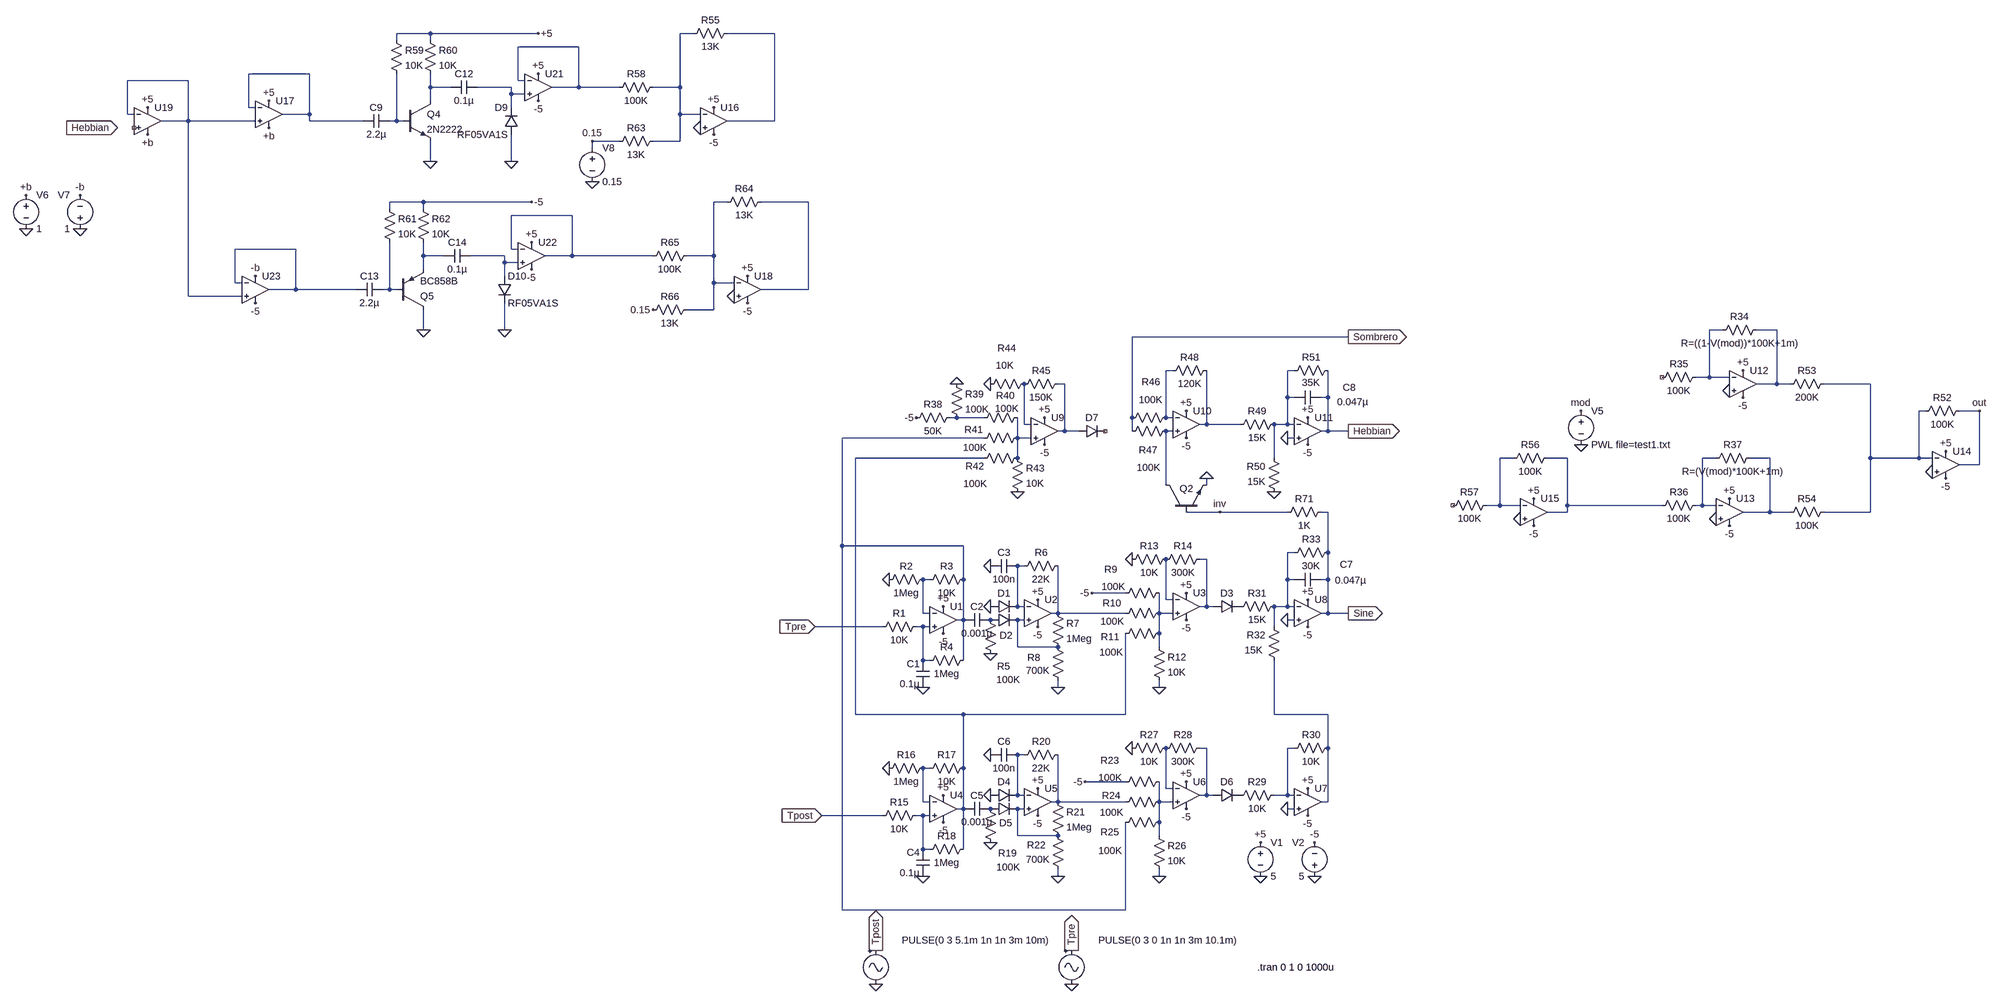
[diagram p0: schematic dopamine-sum-schV2.asc]
dopamine-sum-schV2.asc, the LTspice schematic file:
Version 4
SHEET 1 2868 1552
WIRE -992 -1392 -1072 -1392
WIRE -736 -1392 -992 -1392
WIRE -368 -1392 -400 -1392
WIRE -176 -1392 -288 -1392
WIRE -1072 -1376 -1072 -1392
WIRE -992 -1376 -992 -1392
WIRE -640 -1360 -784 -1360
WIRE -1312 -1296 -1456 -1296
WIRE -1616 -1280 -1760 -1280
WIRE -784 -1280 -784 -1360
WIRE -768 -1280 -784 -1280
WIRE -992 -1264 -992 -1296
WIRE -944 -1264 -992 -1264
WIRE -800 -1264 -880 -1264
WIRE -640 -1264 -640 -1360
WIRE -640 -1264 -704 -1264
WIRE -544 -1264 -640 -1264
WIRE -400 -1264 -400 -1392
WIRE -400 -1264 -464 -1264
WIRE -800 -1248 -800 -1264
WIRE -768 -1248 -800 -1248
WIRE -992 -1232 -992 -1264
WIRE -1456 -1216 -1456 -1296
WIRE -1440 -1216 -1456 -1216
WIRE -800 -1216 -800 -1248
WIRE -1760 -1200 -1760 -1280
WIRE -1744 -1200 -1760 -1200
WIRE -1312 -1200 -1312 -1296
WIRE -1312 -1200 -1376 -1200
WIRE -400 -1200 -400 -1264
WIRE -352 -1200 -400 -1200
WIRE -1616 -1184 -1616 -1280
WIRE -1616 -1184 -1680 -1184
WIRE -1440 -1184 -1616 -1184
WIRE -1312 -1184 -1312 -1200
WIRE -1152 -1184 -1312 -1184
WIRE -1072 -1184 -1072 -1296
WIRE -1072 -1184 -1088 -1184
WIRE -1056 -1184 -1072 -1184
WIRE -176 -1184 -176 -1392
WIRE -176 -1184 -288 -1184
WIRE -544 -1136 -608 -1136
WIRE -400 -1136 -400 -1200
WIRE -400 -1136 -464 -1136
WIRE -608 -1120 -608 -1136
WIRE -992 -1088 -992 -1136
WIRE -800 -1088 -800 -1152
WIRE -1008 -992 -1088 -992
WIRE -752 -992 -1008 -992
WIRE -288 -992 -320 -992
WIRE -96 -992 -208 -992
WIRE -1088 -976 -1088 -992
WIRE -1008 -976 -1008 -992
WIRE -656 -960 -800 -960
WIRE -1344 -880 -1488 -880
WIRE -800 -880 -800 -960
WIRE -784 -880 -800 -880
WIRE -1008 -864 -1008 -896
WIRE -960 -864 -1008 -864
WIRE -816 -864 -896 -864
WIRE -656 -864 -656 -960
WIRE -656 -864 -720 -864
WIRE -464 -864 -656 -864
WIRE -320 -864 -320 -992
WIRE -320 -864 -384 -864
WIRE -816 -848 -816 -864
WIRE -784 -848 -816 -848
WIRE -1008 -832 -1008 -864
WIRE -816 -816 -816 -848
WIRE -1488 -800 -1488 -880
WIRE -1472 -800 -1488 -800
WIRE -320 -800 -320 -864
WIRE -272 -800 -320 -800
WIRE -1344 -784 -1344 -880
WIRE -1344 -784 -1408 -784
WIRE -1168 -784 -1344 -784
WIRE -1088 -784 -1088 -896
WIRE -1088 -784 -1104 -784
WIRE -1072 -784 -1088 -784
WIRE -96 -784 -96 -992
WIRE -96 -784 -208 -784
WIRE -1616 -768 -1616 -1184
WIRE -1472 -768 -1616 -768
WIRE -320 -736 -320 -800
WIRE -320 -736 -384 -736
WIRE -1008 -688 -1008 -736
WIRE -816 -688 -816 -752
WIRE 2160 -688 2128 -688
WIRE 2288 -688 2240 -688
WIRE 1184 -672 672 -672
WIRE 768 -592 752 -592
WIRE 1056 -592 1040 -592
WIRE 2128 -576 2128 -688
WIRE 2128 -576 2096 -576
WIRE 2176 -576 2128 -576
WIRE 512 -560 496 -560
WIRE 2288 -560 2288 -688
WIRE 2288 -560 2240 -560
WIRE 2320 -560 2288 -560
WIRE 2560 -560 2400 -560
WIRE 1040 -528 1040 -592
WIRE 1056 -528 1040 -528
WIRE 1136 -528 1136 -592
WIRE 1136 -528 1120 -528
WIRE 2704 -496 2688 -496
WIRE 2832 -496 2784 -496
WIRE 256 -480 240 -480
WIRE 320 -480 256 -480
WIRE 672 -480 672 -672
WIRE 752 -480 752 -592
WIRE 768 -480 752 -480
WIRE 416 -464 416 -560
WIRE 432 -464 416 -464
WIRE 848 -464 848 -592
WIRE 848 -464 832 -464
WIRE 928 -464 848 -464
WIRE 1040 -464 1040 -528
WIRE 1040 -464 1008 -464
WIRE 1056 -464 1040 -464
WIRE 512 -448 512 -560
WIRE 512 -448 496 -448
WIRE 544 -448 512 -448
WIRE 672 -448 672 -480
WIRE 768 -448 752 -448
WIRE 1136 -448 1136 -528
WIRE 1136 -448 1120 -448
WIRE 1184 -448 1136 -448
WIRE 320 -432 -16 -432
WIRE 400 -432 400 -480
WIRE 432 -432 400 -432
WIRE 1056 -432 1040 -432
WIRE 320 -384 16 -384
WIRE 400 -384 400 -432
WIRE 1008 -384 1008 -464
WIRE 1664 -384 1632 -384
WIRE 1792 -384 1744 -384
WIRE 2144 -384 2112 -384
WIRE 2272 -384 2224 -384
WIRE 2560 -384 2560 -560
WIRE 2688 -384 2688 -496
WIRE 2688 -384 2560 -384
WIRE 2720 -384 2688 -384
WIRE 2832 -368 2832 -496
WIRE 2832 -368 2784 -368
WIRE 752 -320 752 -448
WIRE 848 -320 848 -336
WIRE 1632 -272 1632 -384
WIRE 1632 -272 1600 -272
WIRE 1680 -272 1632 -272
WIRE 1792 -272 1792 -384
WIRE 2016 -272 1792 -272
WIRE 2112 -272 2112 -384
WIRE 2112 -272 2096 -272
WIRE 2144 -272 2112 -272
WIRE 880 -256 800 -256
WIRE 1040 -256 880 -256
WIRE 1136 -256 1120 -256
WIRE 1792 -256 1792 -272
WIRE 1792 -256 1744 -256
WIRE 2272 -256 2272 -384
WIRE 2272 -256 2208 -256
WIRE 2320 -256 2272 -256
WIRE 2560 -256 2560 -384
WIRE 2560 -256 2400 -256
WIRE -16 -176 -16 -432
WIRE 272 -176 -16 -176
WIRE 1056 -160 1040 -160
WIRE 1136 -160 1136 -256
WIRE 848 -144 832 -144
WIRE 416 -128 400 -128
WIRE 192 -96 176 -96
WIRE 272 -96 272 -176
WIRE 1040 -96 1040 -160
WIRE 1056 -96 1040 -96
WIRE 1136 -96 1136 -160
WIRE 1136 -96 1120 -96
WIRE 656 -64 576 -64
WIRE 752 -48 752 -144
WIRE 768 -48 752 -48
WIRE 400 -32 400 -128
WIRE 416 -32 400 -32
WIRE 848 -32 848 -144
WIRE 848 -32 832 -32
WIRE 864 -32 848 -32
WIRE 1040 -32 1040 -96
WIRE 1040 -32 1008 -32
WIRE 1056 -32 1040 -32
WIRE 176 -16 176 -96
WIRE 192 -16 176 -16
WIRE 496 -16 496 -128
WIRE 496 -16 480 -16
WIRE 656 -16 496 -16
WIRE 736 -16 736 -64
WIRE 768 -16 736 -16
WIRE 1136 -16 1136 -96
WIRE 1136 -16 1120 -16
WIRE 1184 -16 1136 -16
WIRE 272 0 272 -96
WIRE 272 0 256 0
WIRE 416 0 400 0
WIRE 1056 0 1040 0
WIRE 80 16 -80 16
WIRE 176 16 160 16
WIRE 192 16 176 16
WIRE 1008 16 1008 -32
WIRE 736 32 736 -16
WIRE 400 64 400 0
WIRE 496 64 400 64
WIRE 736 64 736 32
WIRE 176 96 176 16
WIRE 192 96 176 96
WIRE 272 96 272 0
WIRE 496 160 496 144
WIRE 736 160 736 144
WIRE 16 224 16 -384
WIRE 272 224 16 224
WIRE 656 224 656 32
WIRE 656 224 272 224
WIRE 1008 224 1008 96
WIRE 1136 224 1008 224
WIRE 848 304 832 304
WIRE 1056 304 1040 304
WIRE 1136 304 1136 224
WIRE 416 320 400 320
WIRE 192 352 176 352
WIRE 272 352 272 224
WIRE 656 384 560 384
WIRE 752 400 752 304
WIRE 768 400 752 400
WIRE 400 416 400 320
WIRE 416 416 400 416
WIRE 848 416 848 304
WIRE 848 416 832 416
WIRE 864 416 848 416
WIRE 1040 416 1040 304
WIRE 1040 416 1008 416
WIRE 1056 416 1040 416
WIRE 176 432 176 352
WIRE 192 432 176 432
WIRE 496 432 496 320
WIRE 496 432 480 432
WIRE 656 432 496 432
WIRE 736 432 736 384
WIRE 768 432 736 432
WIRE 1136 432 1136 304
WIRE 1136 432 1120 432
WIRE 272 448 272 352
WIRE 272 448 256 448
WIRE 416 448 400 448
WIRE 1056 448 1040 448
WIRE 80 464 -64 464
WIRE 176 464 160 464
WIRE 192 464 176 464
WIRE 736 480 736 432
WIRE 400 512 400 448
WIRE 496 512 400 512
WIRE 736 512 736 480
WIRE 176 544 176 464
WIRE 192 544 176 544
WIRE 272 544 272 448
WIRE 496 608 496 592
WIRE 736 608 736 592
WIRE -16 688 -16 -176
WIRE 656 688 656 480
WIRE 656 688 -16 688
FLAG 800 -64 +5
FLAG 800 0 -5
FLAG 528 864 0
FLAG 64 864 0
FLAG 224 -32 +5
FLAG 224 32 -5
FLAG 448 -48 +5
FLAG 448 16 -5
FLAG 336 -32 0
FLAG 336 -128 0
FLAG 336 80 0
FLAG 672 -144 0
FLAG 576 -64 -5
FLAG 448 400 +5
FLAG 448 464 -5
FLAG 336 416 0
FLAG 336 320 0
FLAG 336 528 0
FLAG 496 608 0
FLAG 496 160 0
FLAG 800 384 +5
FLAG 800 448 -5
FLAG 672 304 0
FLAG 560 384 -5
FLAG 176 160 0
FLAG 96 -96 0
FLAG 224 416 +5
FLAG 224 480 -5
FLAG 176 608 0
FLAG 96 352 0
FLAG 1088 -48 +5
FLAG 1088 16 -5
FLAG 1088 400 +5
FLAG 1088 464 -5
FLAG 1040 448 0
FLAG 1040 0 0
FLAG 736 160 0
FLAG 736 608 0
FLAG 1184 -16 Sine
IOPIN 1184 -16 Out
FLAG 464 -480 +5
FLAG 464 -416 -5
FLAG 336 -560 0
FLAG 256 -560 0
FLAG 800 -496 +5
FLAG 800 -432 -5
FLAG 160 -480 -5
FLAG 1088 -480 +5
FLAG 1088 -416 -5
FLAG 1040 -432 0
FLAG 1008 -304 0
FLAG 848 -336 0
FLAG 1184 -448 Hebbian
IOPIN 1184 -448 Out
FLAG 1184 -672 Sombrero
IOPIN 1184 -672 Out
FLAG 976 608 0
FLAG 1104 608 0
FLAG 1104 528 -5
FLAG 976 528 +5
FLAG -64 464 Tpost
IOPIN -64 464 In
FLAG 64 784 Tpost
IOPIN 64 784 Out
FLAG -80 16 Tpre
IOPIN -80 16 In
FLAG 528 784 Tpre
IOPIN 528 784 Out
FLAG 400 -304 0
FLAG 2176 -288 +5
FLAG 2176 -224 -5
FLAG 2208 -592 +5
FLAG 2208 -528 -5
FLAG 2176 -544 0
FLAG 2144 -240 0
FLAG 2752 -400 +5
FLAG 2752 -336 -5
FLAG 2720 -352 0
FLAG 1824 -416 0
FLAG 1824 -496 mod
FLAG 2832 -496 out
FLAG 1712 -288 +5
FLAG 1712 -224 -5
FLAG 1680 -240 0
FLAG 880 -256 inv
FLAG -800 -1088 0
FLAG -992 -1088 0
FLAG -736 -1392 +5
FLAG -1408 -1232 +5
FLAG -736 -1296 +5
FLAG -736 -1232 -5
FLAG -816 -688 0
FLAG -1008 -688 0
FLAG -752 -896 +5
FLAG -752 -832 -5
FLAG -752 -992 -5
FLAG -1440 -752 -5
FLAG -2000 -928 0
FLAG -1872 -928 0
FLAG -1872 -1008 -b
FLAG -2000 -1008 +b
FLAG -320 -1216 +5
FLAG -320 -1152 -5
FLAG -352 -1168 0
FLAG -608 -1040 0
FLAG -240 -816 +5
FLAG -240 -752 -5
FLAG -272 -768 0
FLAG -608 -1136 0.15
FLAG -464 -736 0.15
FLAG -1408 -1168 +b
FLAG -1440 -816 -b
FLAG -1712 -1216 +5
FLAG -1712 -1152 +b
FLAG -1904 -1168 Hebbian
IOPIN -1904 -1168 Out
SYMBOL Opamps\\UniversalOpamp2 800 -32 R0
SYMATTR InstName U3
SYMBOL res 848 -160 R90
WINDOW 0 0 56 VBottom 2
WINDOW 3 32 56 VTop 2
SYMATTR InstName R14
SYMATTR Value 300K
SYMBOL res 720 48 R0
SYMATTR InstName R12
SYMATTR Value 10K
SYMBOL res 752 -32 R90
WINDOW 0 8 128 VBottom 2
WINDOW 3 20 127 VTop 2
SYMATTR InstName R10
SYMATTR Value 100K
SYMBOL Opamps\\UniversalOpamp2 224 0 R0
SYMATTR InstName U1
SYMBOL cap 192 160 R180
WINDOW 0 24 56 Left 2
WINDOW 3 24 8 Left 2
SYMATTR InstName C1
SYMATTR Value 0.1µ
SYMBOL res 176 0 R90
WINDOW 0 0 56 VBottom 2
WINDOW 3 32 56 VTop 2
SYMATTR InstName R1
SYMATTR Value 10K
SYMBOL res 176 448 R90
WINDOW 0 0 56 VBottom 2
WINDOW 3 32 56 VTop 2
SYMATTR InstName R15
SYMATTR Value 10K
SYMBOL res 288 -112 R90
WINDOW 0 0 56 VBottom 2
WINDOW 3 32 56 VTop 2
SYMATTR InstName R3
SYMATTR Value 10K
SYMBOL res 752 16 R90
WINDOW 0 40 132 VBottom 2
WINDOW 3 45 130 VTop 2
SYMATTR InstName R11
SYMATTR Value 100K
SYMBOL Opamps\\UniversalOpamp2 448 -16 R0
SYMATTR InstName U2
SYMBOL diode 336 -16 R270
WINDOW 0 32 32 VTop 2
WINDOW 3 0 32 Invisible 2
SYMATTR InstName D1
SYMBOL diode 336 16 R270
WINDOW 0 -36 37 VTop 2
WINDOW 3 0 32 Invisible 2
SYMATTR InstName D2
SYMBOL res 480 -32 R0
SYMATTR InstName R7
SYMATTR Value 1Meg
SYMBOL res 512 160 R180
WINDOW 0 58 71 Left 2
WINDOW 3 36 40 Left 2
SYMATTR InstName R8
SYMATTR Value 700K
SYMBOL res 320 -16 R0
WINDOW 0 32 126 Left 2
WINDOW 3 30 158 Left 2
SYMATTR InstName R5
SYMATTR Value 100K
SYMBOL cap 336 -16 R90
WINDOW 0 0 32 VBottom 2
WINDOW 3 32 32 VTop 2
SYMATTR InstName C2
SYMATTR Value 0.001µ
SYMBOL res 512 -144 R90
WINDOW 0 0 56 VBottom 2
WINDOW 3 32 56 VTop 2
SYMATTR InstName R6
SYMATTR Value 22K
SYMBOL cap 400 -144 R90
WINDOW 0 0 32 VBottom 2
WINDOW 3 32 32 VTop 2
SYMATTR InstName C3
SYMATTR Value 100n
SYMBOL res 656 -128 R270
WINDOW 0 32 56 VTop 2
WINDOW 3 0 56 VBottom 2
SYMATTR InstName R13
SYMATTR Value 10K
SYMBOL diode 864 -16 R270
WINDOW 0 32 32 VTop 2
WINDOW 3 0 32 Invisible 2
SYMATTR InstName D3
SYMBOL res 752 -80 R90
WINDOW 0 -24 131 VBottom 2
WINDOW 3 -15 125 VTop 2
SYMATTR InstName R9
SYMATTR Value 100K
SYMBOL Opamps\\UniversalOpamp2 448 432 R0
SYMATTR InstName U5
SYMBOL diode 336 432 R270
WINDOW 0 32 32 VTop 2
WINDOW 3 0 32 Invisible 2
SYMATTR InstName D4
SYMBOL diode 336 464 R270
WINDOW 0 -33 36 VTop 2
WINDOW 3 0 32 Invisible 2
SYMATTR InstName D5
SYMBOL res 480 416 R0
SYMATTR InstName R21
SYMATTR Value 1Meg
SYMBOL res 512 608 R180
WINDOW 0 45 74 Left 2
WINDOW 3 36 40 Left 2
SYMATTR InstName R22
SYMATTR Value 700K
SYMBOL res 320 432 R0
WINDOW 0 34 121 Left 2
WINDOW 3 30 155 Left 2
SYMATTR InstName R19
SYMATTR Value 100K
SYMBOL res 512 304 R90
WINDOW 0 0 56 VBottom 2
WINDOW 3 32 56 VTop 2
SYMATTR InstName R20
SYMATTR Value 22K
SYMBOL cap 400 304 R90
WINDOW 0 0 32 VBottom 2
WINDOW 3 32 32 VTop 2
SYMATTR InstName C6
SYMATTR Value 100n
SYMBOL cap 336 432 R90
WINDOW 0 0 32 VBottom 2
WINDOW 3 32 32 VTop 2
SYMATTR InstName C5
SYMATTR Value 0.001µ
SYMBOL Opamps\\UniversalOpamp2 800 416 R0
SYMATTR InstName U6
SYMBOL res 848 288 R90
WINDOW 0 0 56 VBottom 2
WINDOW 3 32 56 VTop 2
SYMATTR InstName R28
SYMATTR Value 300K
SYMBOL res 720 496 R0
SYMATTR InstName R26
SYMATTR Value 10K
SYMBOL res 752 416 R90
WINDOW 0 16 130 VBottom 2
WINDOW 3 25 129 VTop 2
SYMATTR InstName R24
SYMATTR Value 100K
SYMBOL res 752 464 R90
WINDOW 0 55 133 VBottom 2
WINDOW 3 68 132 VTop 2
SYMATTR InstName R25
SYMATTR Value 100K
SYMBOL res 656 320 R270
WINDOW 0 32 56 VTop 2
WINDOW 3 0 56 VBottom 2
SYMATTR InstName R27
SYMATTR Value 10K
SYMBOL diode 864 432 R270
WINDOW 0 32 32 VTop 2
WINDOW 3 0 32 Invisible 2
SYMATTR InstName D6
SYMBOL res 752 368 R90
WINDOW 0 -19 133 VBottom 2
WINDOW 3 -9 132 VTop 2
SYMATTR InstName R23
SYMATTR Value 100K
SYMBOL res 1152 -176 R90
WINDOW 0 0 56 VBottom 2
WINDOW 3 32 56 VTop 2
SYMATTR InstName R33
SYMATTR Value 30K
SYMBOL res 1024 -48 R90
WINDOW 0 0 56 VBottom 2
WINDOW 3 32 56 VTop 2
SYMATTR InstName R31
SYMATTR Value 15K
SYMBOL res 1024 112 R180
WINDOW 0 36 76 Left 2
WINDOW 3 43 40 Left 2
SYMATTR InstName R32
SYMATTR Value 15K
SYMBOL res 288 80 R90
WINDOW 0 0 56 VBottom 2
WINDOW 3 32 56 VTop 2
SYMATTR InstName R4
SYMATTR Value 1Meg
SYMBOL res 192 -112 R90
WINDOW 0 0 56 VBottom 2
WINDOW 3 32 56 VTop 2
SYMATTR InstName R2
SYMATTR Value 1Meg
SYMBOL Opamps\\UniversalOpamp2 224 448 R0
SYMATTR InstName U4
SYMBOL cap 192 608 R180
WINDOW 0 24 56 Left 2
WINDOW 3 24 8 Left 2
SYMATTR InstName C4
SYMATTR Value 0.1µ
SYMBOL res 288 336 R90
WINDOW 0 0 56 VBottom 2
WINDOW 3 32 56 VTop 2
SYMATTR InstName R17
SYMATTR Value 10K
SYMBOL res 288 528 R90
WINDOW 0 0 56 VBottom 2
WINDOW 3 32 56 VTop 2
SYMATTR InstName R18
SYMATTR Value 1Meg
SYMBOL res 192 336 R90
WINDOW 0 0 56 VBottom 2
WINDOW 3 32 56 VTop 2
SYMATTR InstName R16
SYMATTR Value 1Meg
SYMBOL Opamps\\UniversalOpamp2 1088 -16 R0
SYMATTR InstName U8
SYMBOL res 1152 288 R90
WINDOW 0 0 56 VBottom 2
WINDOW 3 32 56 VTop 2
SYMATTR InstName R30
SYMATTR Value 10K
SYMBOL Opamps\\UniversalOpamp2 1088 432 R0
SYMATTR InstName U7
SYMBOL res 1024 400 R90
WINDOW 0 0 56 VBottom 2
WINDOW 3 32 56 VTop 2
SYMATTR InstName R29
SYMATTR Value 10K
SYMBOL cap 1120 -112 R90
WINDOW 0 -4 -60 VBottom 2
WINDOW 3 2 -70 VTop 2
SYMATTR InstName C7
SYMATTR Value 0.047µ
SYMBOL Opamps\\UniversalOpamp2 464 -448 R0
SYMATTR InstName U9
SYMATTR SpiceModel level.3b
SYMBOL res 512 -576 R90
WINDOW 0 0 56 VBottom 2
WINDOW 3 32 56 VTop 2
SYMATTR InstName R45
SYMATTR Value 150K
SYMBOL res 384 -400 R0
SYMATTR InstName R43
SYMATTR Value 10K
SYMBOL res 416 -448 R90
WINDOW 0 12 120 VBottom 2
WINDOW 3 23 117 VTop 2
SYMATTR InstName R41
SYMATTR Value 100K
SYMBOL res 320 -544 R270
WINDOW 0 85 55 VTop 2
WINDOW 3 76 50 VBottom 2
SYMATTR InstName R44
SYMATTR Value 10K
SYMBOL res 416 -496 R90
WINDOW 0 -21 45 VBottom 2
WINDOW 3 -21 41 VTop 2
SYMATTR InstName R40
SYMATTR Value 100K
SYMBOL res 240 -576 R0
SYMATTR InstName R39
SYMATTR Value 100K
SYMBOL res 256 -496 R90
WINDOW 0 0 56 VBottom 2
WINDOW 3 32 56 VTop 2
SYMATTR InstName R38
SYMATTR Value 50K
SYMBOL res 864 -608 R90
WINDOW 0 0 56 VBottom 2
WINDOW 3 32 56 VTop 2
SYMATTR InstName R48
SYMATTR Value 120K
SYMBOL Opamps\\UniversalOpamp2 800 -464 R0
SYMATTR InstName U10
SYMBOL res 768 -496 R90
WINDOW 0 -53 52 VBottom 2
WINDOW 3 -42 52 VTop 2
SYMATTR InstName R46
SYMATTR Value 100K
SYMBOL res 768 -464 R90
WINDOW 0 76 58 VBottom 2
WINDOW 3 87 57 VTop 2
SYMATTR InstName R47
SYMATTR Value 100K
SYMBOL npn 752 -256 R270
WINDOW 0 56 32 VRight 2
WINDOW 3 56 68 Invisible 2
SYMATTR InstName Q2
SYMBOL res 1152 -608 R90
WINDOW 0 0 56 VBottom 2
WINDOW 3 60 56 VBottom 2
SYMATTR InstName R51
SYMATTR Value 35K
SYMBOL res 1024 -480 R90
WINDOW 0 0 56 VBottom 2
WINDOW 3 32 56 VTop 2
SYMATTR InstName R49
SYMATTR Value 15K
SYMBOL res 1024 -288 R180
WINDOW 0 36 76 Left 2
WINDOW 3 36 40 Left 2
SYMATTR InstName R50
SYMATTR Value 15K
SYMBOL Opamps\\UniversalOpamp2 1088 -448 R0
SYMATTR InstName U11
SYMBOL cap 1120 -544 R90
WINDOW 0 8 -66 VBottom 2
WINDOW 3 11 -75 VTop 2
SYMATTR InstName C8
SYMATTR Value 0.047µ
SYMBOL res 1024 -240 R270
WINDOW 0 32 56 VTop 2
WINDOW 3 0 56 VBottom 2
SYMATTR InstName R71
SYMATTR Value 1K
SYMBOL voltage 976 512 R0
WINDOW 123 0 0 Left 2
WINDOW 39 0 0 Left 2
SYMATTR InstName V1
SYMATTR Value 5
SYMBOL voltage 1104 624 R180
WINDOW 0 24 96 Left 2
WINDOW 3 24 16 Left 2
WINDOW 123 0 0 Left 2
WINDOW 39 0 0 Left 2
SYMATTR InstName V2
SYMATTR Value 5
SYMBOL Misc\\signal 64 768 R0
WINDOW 0 24 16 Invisible 2
WINDOW 3 62 -8 Left 2
WINDOW 123 0 0 Left 2
WINDOW 39 0 0 Left 2
SYMATTR InstName V3
SYMATTR Value PULSE(0 3 5.1m 1n 1n 3m 10m)
SYMBOL Misc\\signal 528 768 R0
WINDOW 0 24 16 Invisible 2
WINDOW 3 64 -8 Left 2
WINDOW 123 0 0 Left 2
WINDOW 39 0 0 Left 2
SYMATTR InstName V4
SYMATTR Value PULSE(0 3 0 1n 1n 3m 10.1m)
SYMBOL res 416 -400 R90
WINDOW 0 51 117 VBottom 2
WINDOW 3 61 116 VTop 2
SYMATTR InstName R42
SYMATTR Value 100K
SYMBOL Opamps\\UniversalOpamp2 2208 -560 R0
SYMATTR InstName U12
SYMBOL Opamps\\UniversalOpamp2 2176 -256 R0
SYMATTR InstName U13
SYMBOL res 2256 -704 R90
WINDOW 0 0 56 VBottom 2
WINDOW 3 32 56 VTop 2
SYMATTR InstName R34
SYMATTR Value R=((1-V(mod))*100K+1m)
SYMBOL res 2112 -592 R90
WINDOW 0 0 56 VBottom 2
WINDOW 3 32 56 VTop 2
SYMATTR InstName R35
SYMATTR Value 100K
SYMBOL res 2112 -288 R90
WINDOW 0 0 56 VBottom 2
WINDOW 3 32 56 VTop 2
SYMATTR InstName R36
SYMATTR Value 100K
SYMBOL res 2240 -400 R90
WINDOW 0 0 56 VBottom 2
WINDOW 3 32 56 VTop 2
SYMATTR InstName R37
SYMATTR Value R=(V(mod)*100K+1m)
SYMBOL Opamps\\UniversalOpamp2 2752 -368 R0
SYMATTR InstName U14
SYMBOL res 2800 -512 R90
WINDOW 0 0 56 VBottom 2
WINDOW 3 32 56 VTop 2
SYMATTR InstName R52
SYMATTR Value 100K
SYMBOL res 2416 -576 R90
WINDOW 0 0 56 VBottom 2
WINDOW 3 32 56 VTop 2
SYMATTR InstName R53
SYMATTR Value 200K
SYMBOL res 2416 -272 R90
WINDOW 0 0 56 VBottom 2
WINDOW 3 32 56 VTop 2
SYMATTR InstName R54
SYMATTR Value 100K
SYMBOL voltage 1824 -512 R0
WINDOW 123 0 0 Left 2
WINDOW 39 0 0 Left 2
SYMATTR InstName V5
SYMATTR Value PWL file=test1.txt
SYMBOL Opamps\\UniversalOpamp2 1712 -256 R0
SYMATTR InstName U15
SYMBOL res 1760 -400 R90
WINDOW 0 0 56 VBottom 2
WINDOW 3 32 56 VTop 2
SYMATTR InstName R56
SYMATTR Value 100K
SYMBOL res 1616 -288 R90
WINDOW 0 0 56 VBottom 2
WINDOW 3 32 56 VTop 2
SYMATTR InstName R57
SYMATTR Value 100K
SYMBOL cap -1088 -1200 R90
WINDOW 0 0 32 VBottom 2
WINDOW 3 32 32 VTop 2
SYMATTR InstName C9
SYMATTR Value 2.2µ
SYMBOL res -1088 -1392 R0
SYMATTR InstName R59
SYMATTR Value 10K
SYMBOL res -1008 -1392 R0
SYMATTR InstName R60
SYMATTR Value 10K
SYMBOL npn -1056 -1232 R0
SYMATTR InstName Q4
SYMATTR Value 2N2222
SYMBOL cap -880 -1280 R90
WINDOW 0 0 32 VBottom 2
WINDOW 3 32 32 VTop 2
SYMATTR InstName C12
SYMATTR Value 0.1µ
SYMBOL diode -784 -1152 R180
WINDOW 0 24 64 Left 2
WINDOW 3 24 0 Left 2
SYMATTR InstName D9
SYMATTR Value RF05VA1S
SYMBOL Opamps\\UniversalOpamp2 -1408 -1200 R0
SYMATTR InstName U17
SYMBOL Opamps\\UniversalOpamp2 -736 -1264 R0
SYMATTR InstName U21
SYMBOL cap -1104 -800 R90
WINDOW 0 0 32 VBottom 2
WINDOW 3 32 32 VTop 2
SYMATTR InstName C13
SYMATTR Value 2.2µ
SYMBOL res -1104 -992 R0
SYMATTR InstName R61
SYMATTR Value 10K
SYMBOL res -1024 -992 R0
SYMATTR InstName R62
SYMATTR Value 10K
SYMBOL cap -896 -880 R90
WINDOW 0 0 32 VBottom 2
WINDOW 3 32 32 VTop 2
SYMATTR InstName C14
SYMATTR Value 0.1µ
SYMBOL diode -832 -816 R0
SYMATTR InstName D10
SYMATTR Value RF05VA1S
SYMBOL Opamps\\UniversalOpamp2 -752 -864 R0
SYMATTR InstName U22
SYMBOL pnp -1072 -736 M180
SYMATTR InstName Q5
SYMATTR Value BC858B
SYMBOL Opamps\\UniversalOpamp2 -1440 -784 R0
SYMATTR InstName U23
SYMBOL voltage -2000 -1024 R0
WINDOW 123 0 0 Left 2
WINDOW 39 0 0 Left 2
SYMATTR InstName V6
SYMATTR Value 1
SYMBOL voltage -1872 -912 R180
WINDOW 0 24 96 Left 2
WINDOW 3 24 16 Left 2
WINDOW 123 0 0 Left 2
WINDOW 39 0 0 Left 2
SYMATTR InstName V7
SYMATTR Value 1
SYMBOL Opamps\\UniversalOpamp2 -320 -1184 R0
SYMATTR InstName U16
SYMBOL res -272 -1408 R90
WINDOW 0 0 56 VBottom 2
WINDOW 3 32 56 VTop 2
SYMATTR InstName R55
SYMATTR Value 13K
SYMBOL res -448 -1280 R90
WINDOW 0 0 56 VBottom 2
WINDOW 3 32 56 VTop 2
SYMATTR InstName R58
SYMATTR Value 100K
SYMBOL res -448 -1152 R90
WINDOW 0 0 56 VBottom 2
WINDOW 3 32 56 VTop 2
SYMATTR InstName R63
SYMATTR Value 13K
SYMBOL voltage -608 -1136 R0
WINDOW 123 0 0 Left 2
WINDOW 39 0 0 Left 2
SYMATTR InstName V8
SYMATTR Value 0.15
SYMBOL Opamps\\UniversalOpamp2 -240 -784 R0
SYMATTR InstName U18
SYMBOL res -192 -1008 R90
WINDOW 0 0 56 VBottom 2
WINDOW 3 32 56 VTop 2
SYMATTR InstName R64
SYMATTR Value 13K
SYMBOL res -368 -880 R90
WINDOW 0 0 56 VBottom 2
WINDOW 3 32 56 VTop 2
SYMATTR InstName R65
SYMATTR Value 100K
SYMBOL res -368 -752 R90
WINDOW 0 0 56 VBottom 2
WINDOW 3 32 56 VTop 2
SYMATTR InstName R66
SYMATTR Value 13K
SYMBOL Opamps\\UniversalOpamp2 -1712 -1184 R0
SYMATTR InstName U19
SYMBOL diode 544 -432 R270
WINDOW 0 32 32 VTop 2
WINDOW 3 0 32 Invisible 2
SYMATTR InstName D7
TEXT 968 824 Left 2 !.tran 0 1 0 1000u

The netlist it stands for:
* dopamine-sum-schV2.asc
XU3 N039 N037 +5 -5 N034 level.2 Avol=1Meg GBW=10Meg Slew=10Meg ilimit=25m rail=0 Vos=0 phimargin=45 en=0 enk=0 in=0 ink=0 Rin=500Meg  ; pins IN+ IN- V+ V- OUT
R14 N034 N037 300K
R12 N039 0 10K
R10 N039 N038 100K
XU1 N041 N036 +5 -5 N026 level.2 Avol=1Meg GBW=10Meg Slew=10Meg ilimit=25m rail=0 Vos=0 phimargin=45 en=0 enk=0 in=0 ink=0 Rin=500Meg  ; pins IN+ IN- V+ V- OUT
C1 0 N041 0.1µ
R1 N041 Tpre 10K
R15 N051 Tpost 10K
R3 N026 N036 10K
R11 N039 N028 100K
XU2 N040 N035 +5 -5 N038 level.2 Avol=1Meg GBW=10Meg Slew=10Meg ilimit=25m rail=0 Vos=0 phimargin=45 en=0 enk=0 in=0 ink=0 Rin=500Meg  ; pins IN+ IN- V+ V- OUT
D1 0 N035 D
D2 P001 N040 D
R7 N038 N040 1Meg
R8 0 N040 700K
R5 P001 0 100K
C2 P001 N026 0.001µ
R6 N038 N035 22K
C3 N035 0 100n
R13 0 N037 10K
D3 N034 P002 D
R9 N039 -5 100K
XU5 N050 N045 +5 -5 N048 level.2 Avol=1Meg GBW=10Meg Slew=10Meg ilimit=25m rail=0 Vos=0 phimargin=45 en=0 enk=0 in=0 ink=0 Rin=500Meg  ; pins IN+ IN- V+ V- OUT
D4 0 N045 D
D5 P003 N050 D
R21 N048 N050 1Meg
R22 0 N050 700K
R19 P003 0 100K
R20 N048 N045 22K
C6 N045 0 100n
C5 P003 N028 0.001µ
XU6 N049 N047 +5 -5 N043 level.2 Avol=1Meg GBW=10Meg Slew=10Meg ilimit=25m rail=0 Vos=0 phimargin=45 en=0 enk=0 in=0 ink=0 Rin=500Meg  ; pins IN+ IN- V+ V- OUT
R28 N043 N047 300K
R26 N049 0 10K
R24 N049 N048 100K
R25 N049 N026 100K
R27 0 N047 10K
D6 N043 P004 D
R23 N049 -5 100K
R33 Sine N033 30K
R31 N033 P002 15K
R32 N042 N033 15K
R4 N026 N041 1Meg
R2 N036 0 1Meg
XU4 N051 N046 +5 -5 N028 level.2 Avol=1Meg GBW=10Meg Slew=10Meg ilimit=25m rail=0 Vos=0 phimargin=45 en=0 enk=0 in=0 ink=0 Rin=500Meg  ; pins IN+ IN- V+ V- OUT
C4 0 N051 0.1µ
R17 N028 N046 10K
R18 N028 N051 1Meg
R16 N046 0 1Meg
XU8 0 N033 +5 -5 Sine level.2 Avol=1Meg GBW=10Meg Slew=10Meg ilimit=25m rail=0 Vos=0 phimargin=45 en=0 enk=0 in=0 ink=0 Rin=500Meg  ; pins IN+ IN- V+ V- OUT
R30 N042 N044 10K
XU7 0 N044 +5 -5 N042 level.2 Avol=1Meg GBW=10Meg Slew=10Meg ilimit=25m rail=0 Vos=0 phimargin=45 en=0 enk=0 in=0 ink=0 Rin=500Meg  ; pins IN+ IN- V+ V- OUT
R29 N044 P004 10K
C7 Sine N033 0.047µ
XU9 N027 N023 +5 -5 N020 level.3b Avol=1Meg GBW=10Meg Slew=10Meg ilimit=25m rail=0 Vos=0 phimargin=45 en=0 enk=0 in=0 ink=0 Rin=500Meg  ; pins IN+ IN- V+ V- OUT
R45 N020 N023 150K
R43 N027 0 10K
R41 N027 N026 100K
R44 0 N023 10K
R40 N027 N022 100K
R39 0 N022 100K
R38 N022 -5 50K
R48 N024 N018 120K
XU10 N025 N018 +5 -5 N024 level.2 Avol=1Meg GBW=10Meg Slew=10Meg ilimit=25m rail=0 Vos=0 phimargin=45 en=0 enk=0 in=0 ink=0 Rin=500Meg  ; pins IN+ IN- V+ V- OUT
R46 N018 Sombrero 100K
R47 N025 Sombrero 100K
Q2 N025 inv 0 0 NPN
R51 Hebbian N019 35K
R49 N019 N024 15K
R50 0 N019 15K
XU11 0 N019 +5 -5 Hebbian level.2 Avol=1Meg GBW=10Meg Slew=10Meg ilimit=25m rail=0 Vos=0 phimargin=45 en=0 enk=0 in=0 ink=0 Rin=500Meg  ; pins IN+ IN- V+ V- OUT
C8 Hebbian N019 0.047µ
R71 inv Sine 1K
V1 +5 0 5
V2 0 -5 5
V3 Tpost 0 PULSE(0 3 5.1m 1n 1n 3m 10m)
V4 Tpre 0 PULSE(0 3 0 1n 1n 3m 10.1m)
R42 N027 N028 100K
XU12 0 N016 +5 -5 N017 level.2 Avol=1Meg GBW=10Meg Slew=10Meg ilimit=25m rail=0 Vos=0 phimargin=45 en=0 enk=0 in=0 ink=0 Rin=500Meg  ; pins IN+ IN- V+ V- OUT
XU13 0 N031 +5 -5 N032 level.2 Avol=1Meg GBW=10Meg Slew=10Meg ilimit=25m rail=0 Vos=0 phimargin=45 en=0 enk=0 in=0 ink=0 Rin=500Meg  ; pins IN+ IN- V+ V- OUT
R34 N017 N016 R=((1-V(mod))*100K+1m)
R35 N016 NC_01 100K
R36 N031 N030 100K
R37 N032 N031 R=(V(mod)*100K+1m)
XU14 0 N021 +5 -5 out level.2 Avol=1Meg GBW=10Meg Slew=10Meg ilimit=25m rail=0 Vos=0 phimargin=45 en=0 enk=0 in=0 ink=0 Rin=500Meg  ; pins IN+ IN- V+ V- OUT
R52 out N021 100K
R53 N021 N017 200K
R54 N021 N032 100K
V5 mod 0 PWL file=test1.txt
XU15 0 N029 +5 -5 N030 level.2 Avol=1Meg GBW=10Meg Slew=10Meg ilimit=25m rail=0 Vos=0 phimargin=45 en=0 enk=0 in=0 ink=0 Rin=500Meg  ; pins IN+ IN- V+ V- OUT
R56 N030 N029 100K
R57 N029 NC_02 100K
C9 N008 N004 2.2µ
R59 +5 N008 10K
R60 +5 N006 10K
Q4 N006 N008 0 0 2N2222
C12 N007 N006 0.1µ
D9 0 N007 RF05VA1S
XU17 N005 N004 +5 +b N004 level.2 Avol=1Meg GBW=10Meg Slew=10Meg ilimit=25m rail=0 Vos=0 phimargin=45 en=0 enk=0 in=0 ink=0 Rin=500Meg  ; pins IN+ IN- V+ V- OUT
XU21 N007 N003 +5 -5 N003 level.2 Avol=1Meg GBW=10Meg Slew=10Meg ilimit=25m rail=0 Vos=0 phimargin=45 en=0 enk=0 in=0 ink=0 Rin=500Meg  ; pins IN+ IN- V+ V- OUT
C13 N015 N012 2.2µ
R61 -5 N015 10K
R62 -5 N013 10K
C14 N014 N013 0.1µ
D10 N014 0 RF05VA1S
XU22 N014 N011 +5 -5 N011 level.2 Avol=1Meg GBW=10Meg Slew=10Meg ilimit=25m rail=0 Vos=0 phimargin=45 en=0 enk=0 in=0 ink=0 Rin=500Meg  ; pins IN+ IN- V+ V- OUT
Q5 0 N015 N013 0 BC858B
XU23 N005 N012 -b -5 N012 level.2 Avol=1Meg GBW=10Meg Slew=10Meg ilimit=25m rail=0 Vos=0 phimargin=45 en=0 enk=0 in=0 ink=0 Rin=500Meg  ; pins IN+ IN- V+ V- OUT
V6 +b 0 1
V7 0 -b 1
XU16 0 N001 +5 -5 N002 level.2 Avol=1Meg GBW=10Meg Slew=10Meg ilimit=25m rail=0 Vos=0 phimargin=45 en=0 enk=0 in=0 ink=0 Rin=500Meg  ; pins IN+ IN- V+ V- OUT
R55 N002 N001 13K
R58 N001 N003 100K
R63 N001 0.15 13K
V8 0.15 0 0.15
XU18 0 N009 +5 -5 N010 level.2 Avol=1Meg GBW=10Meg Slew=10Meg ilimit=25m rail=0 Vos=0 phimargin=45 en=0 enk=0 in=0 ink=0 Rin=500Meg  ; pins IN+ IN- V+ V- OUT
R64 N010 N009 13K
R65 N009 N011 100K
R66 N009 0.15 13K
XU19 NC_03 N005 +5 +b N005 level.2 Avol=1Meg GBW=10Meg Slew=10Meg ilimit=25m rail=0 Vos=0 phimargin=45 en=0 enk=0 in=0 ink=0 Rin=500Meg  ; pins IN+ IN- V+ V- OUT
D7 N020 NC_04 D
.model D D
.lib standard.dio
.model NPN NPN
.model PNP PNP
.lib standard.bjt
.tran 0 1 0 1000u
.lib UniversalOpamps2.sub
.backanno
.end